# Altium schematic sheet Connectors.SchDoc
size A4
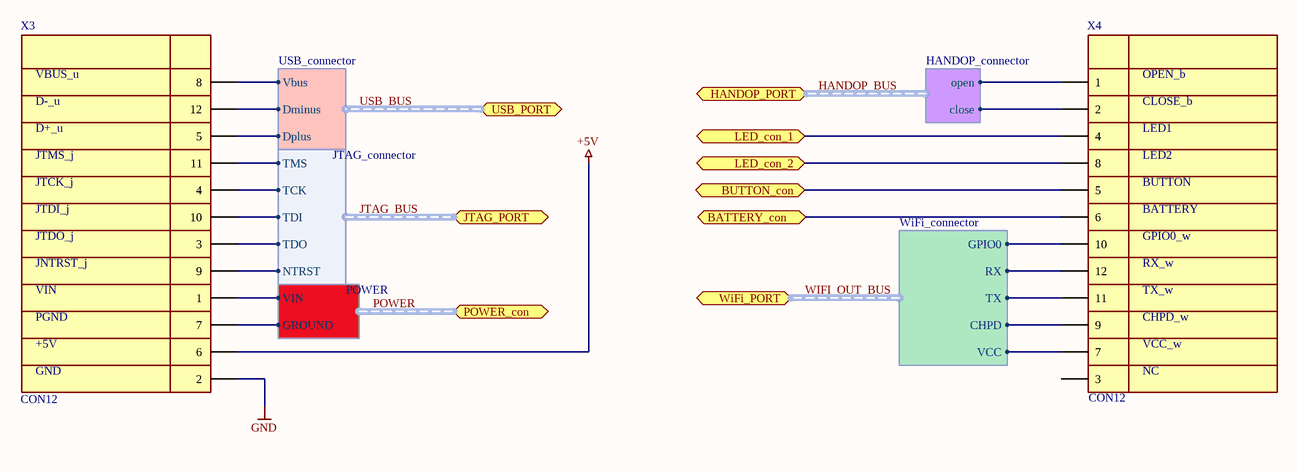
[diagram p0: Connectors.SchDoc]

## Parts
X3  CON12  [HDR2X6_CEN]
X4  CON12  [HDR2X6_CEN]

## Ports
BATTERY_con, BUTTON_con, HANDOP_PORT (harness HANDOP_connector), JTAG_PORT (harness JTAG_connector), LED_con_1, LED_con_2, POWER_con (harness POWER), USB_PORT (harness USB_connector), WiFi_PORT (harness WiFi_connector)

## Harnesses
HANDOP_connector: open, close
WiFi_connector: GPIO0, RX, TX, CHPD, VCC
POWER: VIN, GROUND
JTAG_connector: TMS, TCK, TDI, TDO, NTRST
USB_connector: Vbus, Dminus, Dplus

## Nets
+5V: X3.6
GND: X3.2
BATTERY_con: X4.6 ; port BATTERY_con
BUTTON_con: X4.5 ; port BUTTON_con
HANDOP_BUS.close: X4.2 ; port HANDOP_PORT.close
HANDOP_BUS.open: X4.1 ; port HANDOP_PORT.open
JTAG_BUS.NTRST: X3.9 ; port JTAG_PORT.NTRST
JTAG_BUS.TCK: X3.4 ; port JTAG_PORT.TCK
JTAG_BUS.TDI: X3.10 ; port JTAG_PORT.TDI
JTAG_BUS.TDO: X3.3 ; port JTAG_PORT.TDO
JTAG_BUS.TMS: X3.11 ; port JTAG_PORT.TMS
LED_con_1: X4.4 ; port LED_con_1
LED_con_2: X4.8 ; port LED_con_2
POWER.GROUND: X3.7 ; port POWER_con.GROUND
POWER.VIN: X3.1 ; port POWER_con.VIN
USB_BUS.Dminus: X3.12 ; port USB_PORT.Dminus
USB_BUS.Dplus: X3.5 ; port USB_PORT.Dplus
USB_BUS.Vbus: X3.8 ; port USB_PORT.Vbus
WIFI_OUT_BUS.CHPD: X4.9 ; port WiFi_PORT.CHPD
WIFI_OUT_BUS.GPIO0: X4.10 ; port WiFi_PORT.GPIO0
WIFI_OUT_BUS.RX: X4.12 ; port WiFi_PORT.RX
WIFI_OUT_BUS.TX: X4.11 ; port WiFi_PORT.TX
WIFI_OUT_BUS.VCC: X4.7 ; port WiFi_PORT.VCC

Not connected (* = marked no-connect by the designer): X4 3

## Buses and harness runs
harness HANDOP_BUS = port HANDOP_PORT
harness JTAG_BUS = port JTAG_PORT
harness POWER = port POWER_con
harness USB_BUS = port USB_PORT
harness WIFI_OUT_BUS = port WiFi_PORT

## Notes on the sheet
- VBUS_u
- D-_u
- D+_u
- OPEN_b
- CLOSE_b
- LED1
- JTMS_j
- JTCK_j
- BUTTON
- LED2
- JTDI_j
- JTDO_j
- JNTRST_j
- BATTERY
- GPIO0_w
- RX_w
- VIN
- PGND
- TX_w
- CHPD_w
- +5V
- GND
- NC
- VCC_w

## Library data of the parts
X3 X4 = CON12: штыри(мама)